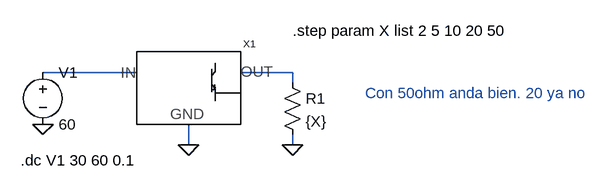
[diagram p0: schematic pruebaMiRegDePotencia.asc]
pruebaMiRegDePotencia.asc, the LTspice schematic file:
Version 4
SHEET 1 880 680
WIRE 64 112 -80 112
WIRE 304 112 224 112
WIRE 304 128 304 112
WIRE 144 224 144 192
WIRE 304 224 304 208
FLAG -80 192 0
FLAG 144 224 0
FLAG 304 224 0
SYMBOL RegDePotencia 144 128 R0
SYMATTR InstName X1
SYMBOL voltage -80 96 R0
WINDOW 123 0 0 Left 0
WINDOW 39 0 0 Left 0
SYMATTR InstName V1
SYMATTR Value 60
SYMBOL res 288 112 R0
SYMATTR InstName R1
SYMATTR Value {X}
TEXT 304 48 Left 2 !.step param X list 2 5 10 20 50
TEXT -114 248 Left 2 !.dc V1 30 60 0.1
TEXT 416 144 Left 2 ;Con 50ohm anda bien. 20 ya no

The netlist it stands for:
* pruebaMiRegDePotencia.asc
XX1 N001 N002 0 RegDePotencia  ; pins IN OUT ground
V1 N001 0 60
R1 N002 0 {X}
.step param X list 2 5 10 20 50
.dc V1 30 60 0.1
* Con 50ohm anda bien. 20 ya no
.backanno
.end